# EAGLE design Isolator (EAGLE 8.2.2)
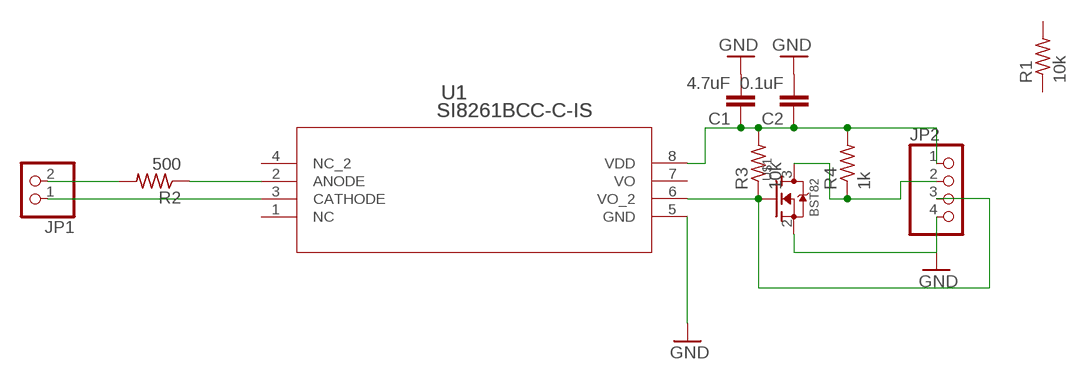
[diagram p0: schematic, sheet 1]

## Parts
C1  4.7uF  C-EUC0402  [C0402]
C2  0.1uF  C-EUC0402  [C0402]
JP1  PINHD-1X2  [1X02]
JP2  PINHD-1X4  [1X04]
R1  10k  R-US_R0402  [R0402]
R2  500  R-US_R0402  [R0402]
R3  10k  R-US_R0402  [R0402]
R4  1k  R-US_R0402  [R0402]
U1  SI8261BCC-C-IS  [SOIC_8_127MM]
U$1  BST82  [SOT23-3]

## Nets
GND: C1.2 C2.2 JP2.4 U1.5(GND) U$1.2(S)
N$1: C1.1 C2.1 JP2.1 R3.2 R4.2 U1.8(VDD)
N$2: JP2.3 R3.1 U1.6(VO_2) U$1.1(G)
N$3: JP1.2 R2.2
N$4: JP2.2 R4.1 U$1.3(D)
N$5: R2.1 U1.2(ANODE)
N$6: JP1.1 U1.3(CATHODE)
Unconnected: R1.1 R1.2 U1.1(NC) U1.4(NC_2) U1.7(VO)

## Library data of the parts
C1 C2 = rcl:C-EU: CAPACITOR, European symbol
JP1 = pinhead:PINHD-1X2: PIN HEADER
JP2 = pinhead:PINHD-1X4: PIN HEADER
R1-R4 = rcl:R-US_: RESISTOR, American symbol
U1 = Charles:SI8261BCC-C-IS
U$1 = Charles:BST82: MOSFET N-CH 50V 220MA

## Board
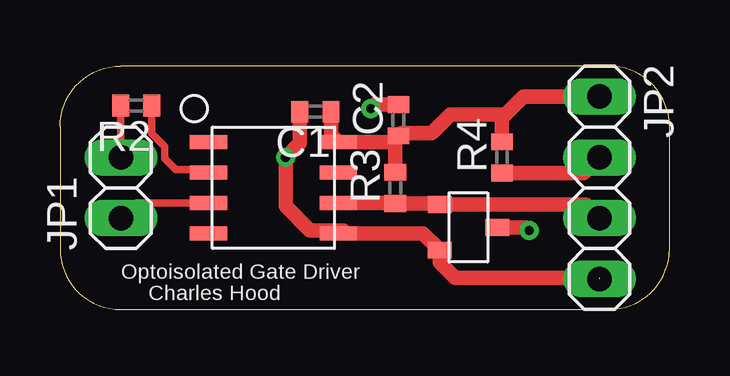
[diagram p1: board, top side]
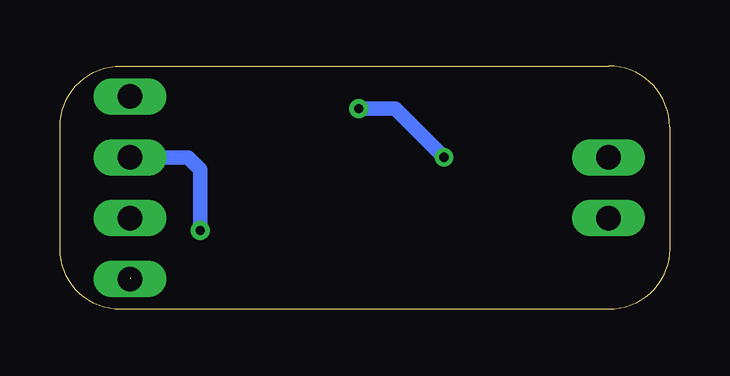
[diagram p2: board, bottom side, seen from below]

Size 25.4 x 10.16 mm. Coordinates in mm from the lower left corner, seen from the top.
Outline: 2.54,0 22.86,0 arc90 25.4,2.54 25.4,7.62 arc90 22.86,10.16 2.54,10.16 arc90 0,7.62 0,2.54 arc90 2.54,0
Copper layers (1*16): Top 0.035mm / dielectric 1.5mm / Bottom 0.035mm
Design rules "default": minimum track width 6mil, minimum drill 0.35mm, track to track 6mil, track to pad 6mil, pad to pad 6mil, via to via 6mil, smd to smd 6mil, copper to edge 40mil, drill to drill 6mil, minimum pad ring 10mil, minimum via ring 8mil, stop-mask expansion 4mil, vias tented up to drill 0mil, thermal gap 10mil

### Footprints (pad centres in the part's own frame; a part is rotated, then mirrored left to right if it is on the bottom)
C0402 = smd 0.7 x 0.9: 1 -0.65,0; 2 0.65,0
1X02 = drill 1.016 long: 1 -1.27,0; 2 1.27,0
1X04 = drill 1.016 long: 1 -3.81,0; 2 -1.27,0; 3 1.27,0; 4 3.81,0
R0402 = smd 0.7 x 0.9: 1 -0.65,0; 2 0.65,0
SOIC_8_127MM = smd 1.55 x 0.6: 1 -2.7,1.905; 2 -2.7,0.635; 3 -2.7,-0.635; 4 -2.7,-1.905; 5 2.7,-1.905; 6 2.7,-0.635; 7 2.7,0.635; 8 2.7,1.905
SOT23-3 = smd 0.7 x 1: 1 -0.95,-1.2; 2 0.95,-1.2; 3 0,1.2

### Placement (x,y rotation side)
C1  10.64,8.25 180 top
C2  14.1,7.9 90 top
JP1  2.54,5.08 90 top
JP2  22.48,5.08 270 top
R1  17.78,24.13 0 top  (outside the outline)
R2  3.18,8.51 180 top
R3  13.97,5.08 90 top
R4  18.42,6.35 90 top
U1  8.89,5.08 0 top
U$1  17.02,3.43 270 top

### Tracks (layer width: path | path; a pad name or v marks a point on that pad's centre or on a via)
GND  (via drill 0.38)  (1 unrouted)
  Top 0.61: 11.92,3.18 U1.5 | 11.92,3.18 15.12,3.18 U$1.2 15.82,1.96 16.46,1.32 22.48,1.32 | C2.2 13.12,8.55 v12.95,8.38 | 11.92,3.18 11.79,3.3 10.41,3.3 9.4,4.32 v9.4,6.35 9.99,6.94 C1.2
  Bottom 0.61: v12.95,8.38 11.43,8.38 v9.4,6.35
N$1
  Top 0.61: JP2.1 19.3,8.89 18.54,8.13 | 18.54,8.13 16.26,8.13 15.49,7.37 14.21,7.37 | 14.21,7.37 C2.1 13.83,6.98 U1.8 11.29,7.28 C1.1 | R3.2 13.97,7.12 14.21,7.37 | R4.2 18.42,8 18.54,8.13
N$2
  Top 0.61: U1.6 13.96,4.45 R3.1 15.77,4.43 U$1.1 21.91,4.38 JP2.3
N$3
  Top 0.305: JP1.2 2.54,8.49 R2.2
N$4  (via drill 0.38)
  Top 0.61: U$1.3 19.43,3.43 v19.56,3.3 | R4.1 21.83,5.7 JP2.2
  Bottom 0.61: v19.56,3.3 19.56,5.84 20.07,6.35 JP2.2
N$5
  Top 0.305: R2.1 3.82,7.34 4.37,6.79 4.37,6.3 4.83,5.84 6.06,5.84 U1.2
N$6
  Top 0.305: U1.3 3.18,4.45 JP1.1

### Text on the board
tPlace: Optoisolated Gate Driver | Charles Hood